# EAGLE design DCDCDC (EAGLE 9.1.3)
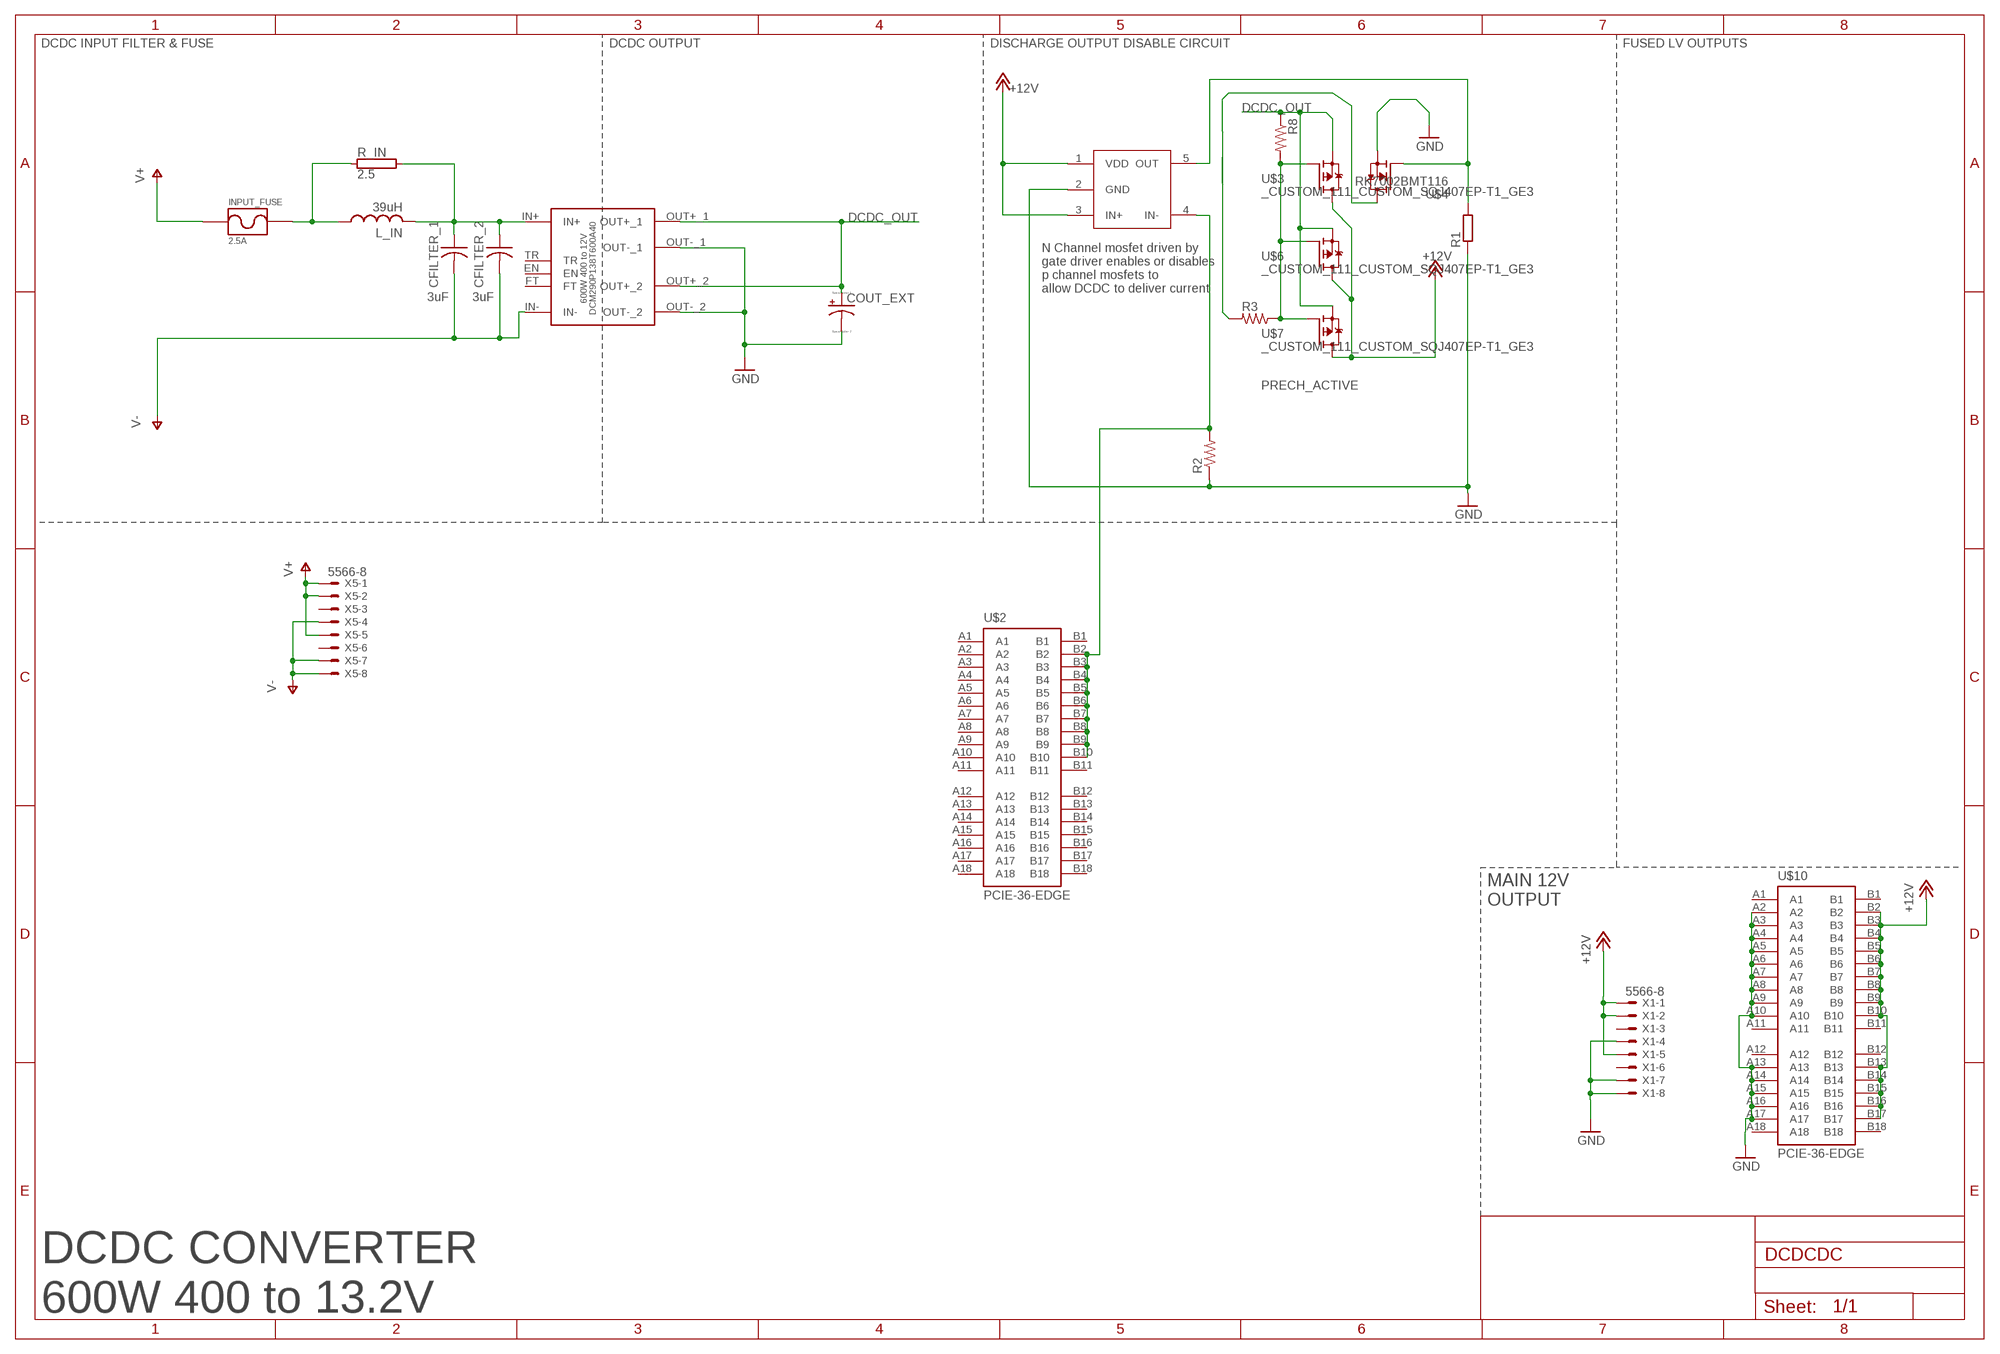
[diagram p0: schematic, sheet 1]

## Parts
CFILTER_1  3uF  B58035U5305M062  [CERALINK_FA3]
CFILTER_2  3uF  B58035U5305M062  [CERALINK_FA3]
COUT_EXT  CPOL-USE7.5-16  [E7,5-16]
DCM290P138T600A40  600W 400 to 12V  VICOR_CHIP_WITH_HEATSINK  [VICOR_CHIP_HEATSINK]
INPUT_FUSE  2.5A  _CUSTOM_PARTS_LF_885  [_CUSTOM_PARTS_LF_885]
L_IN  39uH  SRP1770TA-390M  [L_1510_NONSTANDARD]
R1  R-EU_R0805  [R0805]
R2  R-US_R0805  [R0805]
R3  R-US_R0805  [R0805]
R8  R-US_R0805  [R0805]
R_IN  2.5  RMG100-V  [TO-247-2V]
U$2  PCIE-36-EDGE  [PCI-E_SLOT_36]
U$3  _CUSTOM_111_CUSTOM_SQJ407EP-T1_GE3  [_CUSTOM_111_CUSTOM_TRANS_SIRA90DP-T1-GE3]
U$4  RK7002BMT116  [SOT23]
U$5  UCC27511AQDBVRQ1  [SOT23-5L]
U$6  _CUSTOM_111_CUSTOM_SQJ407EP-T1_GE3  [_CUSTOM_111_CUSTOM_TRANS_SIRA90DP-T1-GE3]
U$7  _CUSTOM_111_CUSTOM_SQJ407EP-T1_GE3  [_CUSTOM_111_CUSTOM_TRANS_SIRA90DP-T1-GE3]
U$10  PCIE-36-EDGE  [PCI-E_SLOT_36]
X1  5566-8  [5566-8]
X5  5566-8  [5566-8]

## Nets
+12V: U$3.5(D) U$5.1(VDD) U$5.3(IN+) U$6.5(D) U$7.5(D) U$10.B2 U$10.B3 U$10.B4 U$10.B5 U$10.B6 U$10.B7 U$10.B8 U$10.B9 U$10.B10 U$10.B13 U$10.B14 U$10.B15 U$10.B16 U$10.B17
DCDC_OUT: COUT_EXT.+ DCM290P138T600A40.OUT+_1 DCM290P138T600A40.OUT+_2 R8.1 U$3.1(S) U$3.2(S) U$3.3(S) U$6.1(S) U$6.2(S) U$6.3(S) U$7.1(S) U$7.2(S) U$7.3(S)
GND: COUT_EXT.- DCM290P138T600A40.OUT-_1 DCM290P138T600A40.OUT-_2 R1.1 R2.1 U$4.2(S) U$5.2(GND) U$10.A2 U$10.A3 U$10.A4 U$10.A5 U$10.A6 U$10.A7 U$10.A8 U$10.A9 U$10.A10 U$10.A13 U$10.A14 U$10.A15 U$10.A16 U$10.A17
N$1: R3.1 R8.2 U$3.4(G) U$6.4(G) U$7.4(G)
N$2: R1.2 U$4.1(G) U$5.5(OUT)
N$3 [LV]: CFILTER_1.P$1 CFILTER_2.P$1 DCM290P138T600A40.IN+ L_IN.P$2 R_IN.2
N$4: R3.2 U$4.3(D)
N$5 [LV]: X1.1 X1.2 X1.5
N$6 [LV]: X1.4 X1.7 X1.8
PRECH_ACTIVE: R2.2 U$2.B2 U$2.B3 U$2.B4 U$2.B5 U$2.B6 U$2.B7 U$2.B8 U$2.B9 U$2.B10 U$5.4(IN-)
V+ [LV]: INPUT_FUSE.P$1 X5.1 X5.2 X5.5
V+_FUSED [LV]: INPUT_FUSE.P$2 L_IN.P$1 R_IN.1
V- [LV]: CFILTER_1.P$2 CFILTER_2.P$2 DCM290P138T600A40.IN- X5.4 X5.7 X5.8
Unconnected: DCM290P138T600A40.EN DCM290P138T600A40.FT DCM290P138T600A40.TR U$2.A1 U$2.A2 U$2.A3 U$2.A4 U$2.A5 U$2.A6 U$2.A7 U$2.A8 U$2.A9 U$2.A10 U$2.A11 U$2.A12 U$2.A13 U$2.A14 U$2.A15 U$2.A16 U$2.A17 U$2.A18 U$2.B1 U$2.B11 U$2.B12 U$2.B13 U$2.B14 U$2.B15 U$2.B16 U$2.B17 U$2.B18 U$10.A1 U$10.A11 U$10.A12 U$10.A18 U$10.B1 U$10.B11 U$10.B12 U$10.B18 X1.3 X1.6 X5.3 X5.6

## Notes on the sheet
- DCDC INPUT FILTER & FUSE | DCDC OUTPUT | DISCHARGE OUTPUT DISABLE CIRCUIT | FUSED LV OUTPUTS
- N Channel mosfet driven by 
  gate driver enables or disables 
  p channel mosfets to 
  allow DCDC to deliver current
- MAIN 12V
  OUTPUT
- DCDC CONVERTER 
  600W 400 to 13.2V

## Library data of the parts
CFILTER_1 CFILTER_2 = _CUSTOM:B58035U5305M062
COUT_EXT = resistor:CPOL-US: POLARIZED CAPACITOR, American symbol
DCM290P138T600A40 = 111_Custom:VICOR_CHIP_WITH_HEATSINK
INPUT_FUSE = _CUSTOM:_CUSTOM_PARTS_LF_885
L_IN = _CUSTOM:SRP1770TA-390M
R1 = rcl:R-EU_: RESISTOR, European symbol; SPICEPREFIX: R
R2 R3 R8 = rcl:R-US_: RESISTOR, American symbol; SPICEPREFIX: R
R_IN = resistor-power:RMG100: TO-247 Power Resistor - RMG 100 Series Source: www.token.com.tw .. power-resistor-rmg100pdf; OC_FARNELL: unknown; OC_NEWARK: unknown
U$2 U$10 = ACC-MB-R0:PCIE-36-EDGE
U$3 U$6 U$7 = PDM_2019_RevB:_CUSTOM_111_CUSTOM_SQJ407EP-T1_GE3
U$4 = 111_Custom:RK7002BMT116
U$5 = _CUSTOM:UCC27511AQDBVRQ1
X1 X5 = con-molex:5566-8: Mini FIT connector 8 pol Source: http://www.molex.com; MF: MOLEX; OC_FARNELL: unknown; OC_NEWARK: unknown

## Net classes
0 default: width 1 mm, clearance 0.152 mm
1 LV: clearance 0.001 mm

## Board
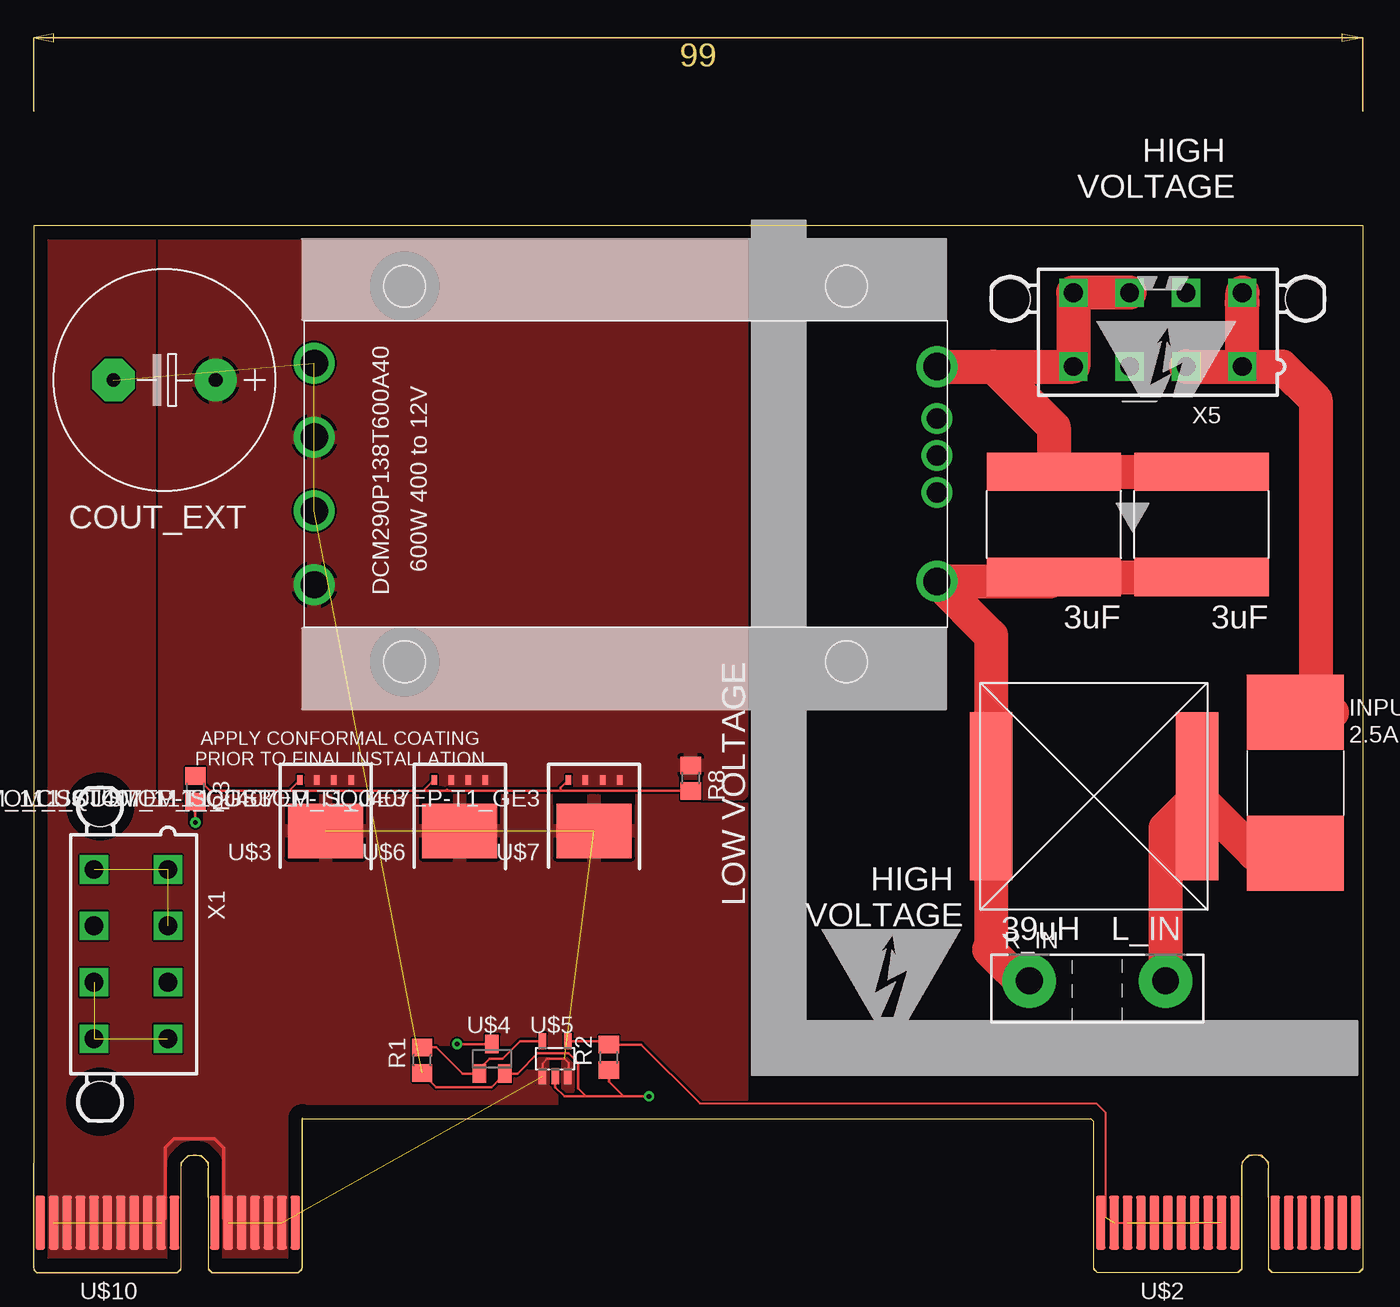
[diagram p1: board, top side]
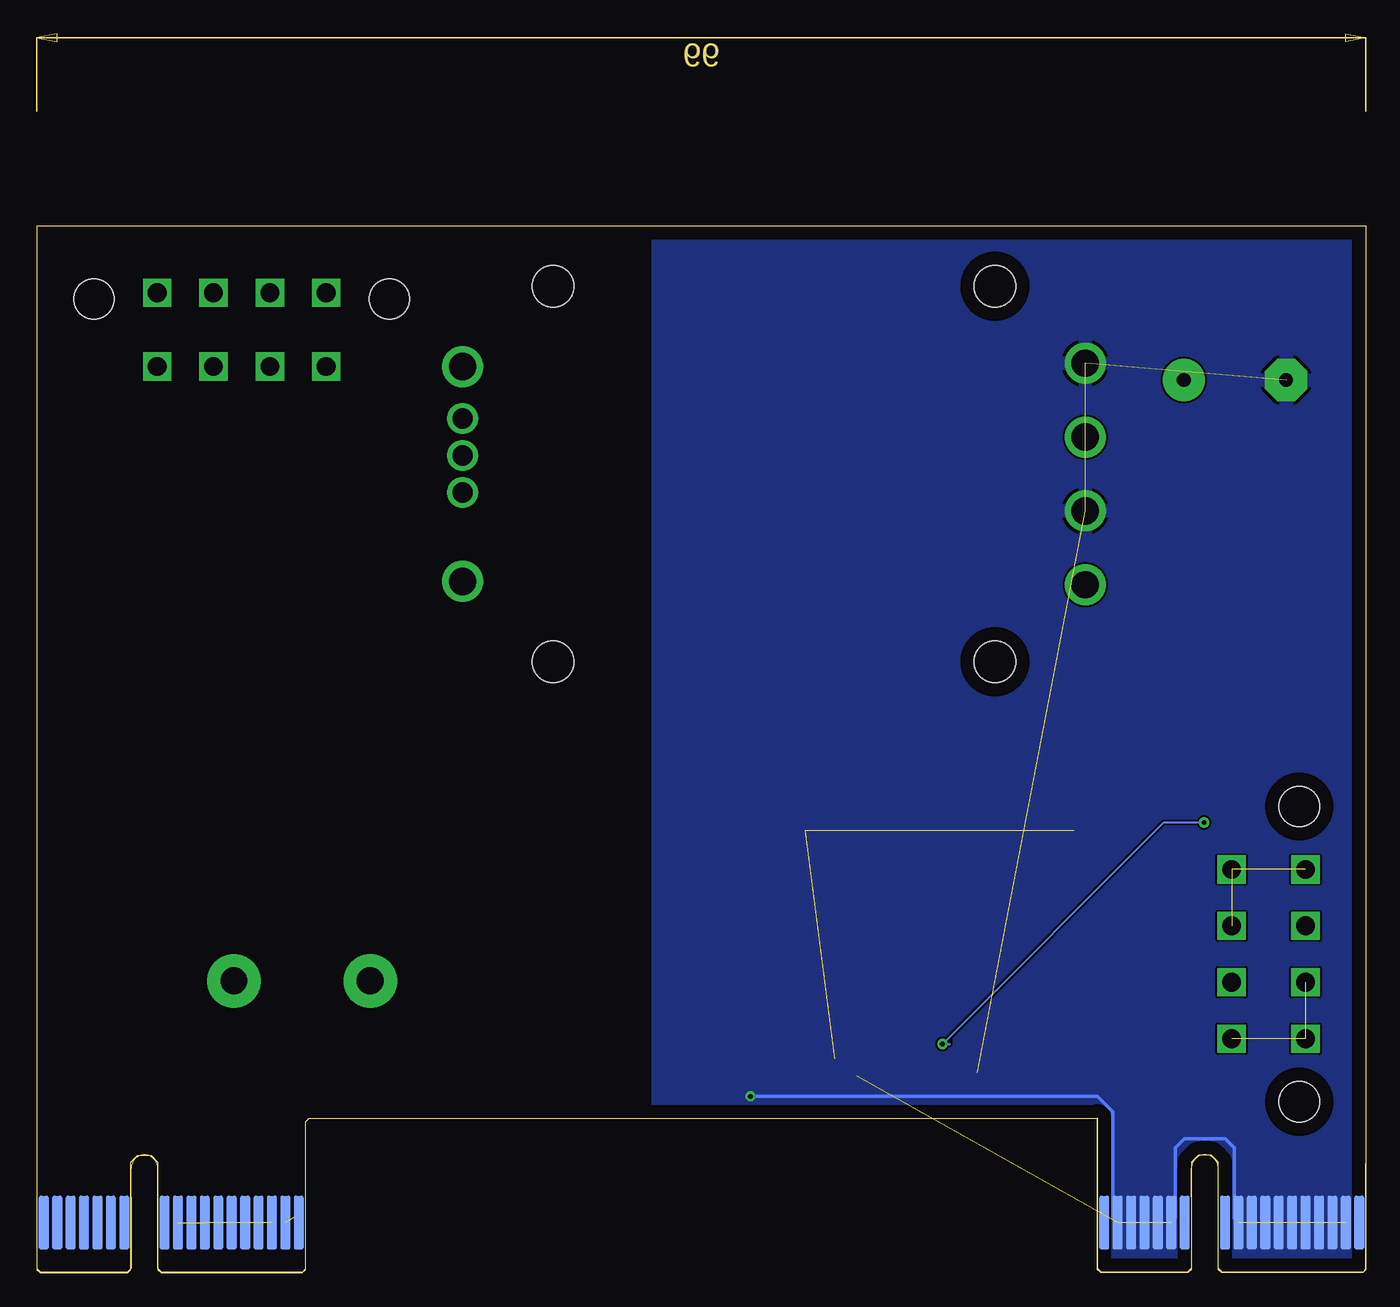
[diagram p2: board, bottom side, seen from below]

Size 99 x 78 mm. Coordinates in mm from the lower left corner, seen from the top.
Outline: 99,78 0,78 0,0.25 0.25,0 10.75,0 11,0.25 11,8.25 11.5,8.75 12.5,8.75 13,8.25 13,0.25 13.25,0 19.75,0 20,0.25 20,11.5 78.75,11.5 79,11.25 79,0.25 79.25,0 89.75,0 90,0.25 90,8.25 90.5,8.75 91.5,8.75 92,8.25 92,0.25 92.25,0 98.75,0 99,0.25 99,78
Copper layers (1*16): Top 0.035mm / dielectric 1.5mm / Bottom 0.035mm
Design rules "default": minimum track width 6mil, minimum drill 0.35mm, track to track 6mil, track to pad 6mil, pad to pad 6mil, via to via 6mil, smd to smd 6mil, copper to edge 40mil, drill to drill 6mil, minimum pad ring 10mil, minimum via ring 8mil, stop-mask expansion 4mil, vias tented up to drill 0mil, thermal gap 10mil

### Footprints (pad centres in the part's own frame; a part is rotated, then mirrored left to right if it is on the bottom)
CERALINK_FA3 = smd 2.85 x 10: P$1 -3.925,0; P$2 3.925,0
E7,5-16 = drill 1.016 pad 3.15: + -3.81,0 | drill 1.016 pad 3.15 octagon: - 3.81,0
VICOR_CHIP_HEATSINK = drill 1.52 pad 1.77: EN -23.19,-1.38; FT -23.19,-4.13; TR -23.19,1.38 | drill 2.03 pad 2.28: IN+ -23.19,8; IN- -23.19,-8 | drill 2.03 pad 2.41: OUT+_1 23.19,8.25; OUT+_2 23.19,-2.75; OUT-_1 23.19,2.75; OUT-_2 23.19,-8.25 | hole 3.1: -16.47,13.97; -16.47,-13.97; 16.47,13.97; 16.47,-13.97
_CUSTOM_PARTS_LF_885 = smd 5.6 x 7.23: P$1 5.25,0; P$2 -5.25,0
L_1510_NONSTANDARD = smd 3.15 x 12.5: P$1 -7.675,0; P$2 7.675,0
R0805 = smd 1.3 x 1.5: 1 -0.95,0; 2 0.95,0
TO-247-2V = drill 2 pad 4: 1 -5.08,0; 2 5.08,0
PCI-E_SLOT_36 = smd 0.7 x 4 bottom: A1 0.245,3.75; A2 1.245,3.75; A3 2.245,3.75; A4 3.245,3.75; A5 4.245,3.75; A6 5.245,3.75; A7 6.245,3.75; A8 7.245,3.75; A9 8.245,3.75; A10 9.245,3.75; A11 10.245,3.75; A12 13.245,3.75; A13 14.245,3.75; A14 15.245,3.75; A15 16.245,3.75; A16 17.245,3.75; A17 18.245,3.75; A18 19.245,3.75 | smd 0.7 x 4: B1 0.245,3.75; B2 1.245,3.75; B3 2.245,3.75; B4 3.245,3.75; B5 4.245,3.75; B6 5.245,3.75; B7 6.245,3.75; B8 7.245,3.75; B9 8.245,3.75; B10 9.245,3.75; B11 10.245,3.75; B12 13.245,3.75; B13 14.245,3.75; B14 15.245,3.75; B15 16.245,3.75; B16 17.245,3.75; B17 18.245,3.75; B18 19.245,3.75
_CUSTOM_111_CUSTOM_TRANS_SIRA90DP-T1-GE3 = smd 0.41 x 0.72: 1 -1.905,-2.715; 2 -0.635,-2.715; 3 0.635,-2.715; 4 1.905,-2.715 | smd 5.588 x 4.064: 5 0,1.08
SOT23 = smd 1 x 1.4: 1 -0.95,-1.1; 2 0.95,-1.1; 3 0,1.1
SOT23-5L = smd 0.55 x 1.2: 1 -0.95,-1.3; 2 0,-1.3; 3 0.95,-1.3; 4 0.95,1.3; 5 -0.95,1.3
5566-8 = drill 1.4 square: 1 6.3,-2.75; 2 2.1,-2.75; 3 -2.1,-2.75; 4 -6.3,-2.75; 5 6.3,2.75; 6 2.1,2.75; 7 -2.1,2.75; 8 -6.3,2.75 | hole 3: 11,2.29; -11,2.29

### Placement (x,y rotation side)
CFILTER_1  87,55.75 90 top
CFILTER_2  76,55.75 90 top
COUT_EXT  9.75,66.5 180 top
DCM290P138T600A40  44.1,59.5 180 top
INPUT_FUSE  94,36.5 90 top
L_IN  79,35.5 180 top
R1  28.95,15.85 90 top
R2  42.85,16.05 90 top
R3  12.05,36.05 270 top
R8  48.95,36.85 270 top
R_IN  79.25,21.75 180 top
U$2  79.25,0 0 top
U$3  21.75,34 180 top
U$4  34.15,15.95 0 top
U$5  38.85,15.95 0 top
U$6  31.75,34 180 top
U$7  41.75,34 180 top
U$10  0.25,0 0 top
X1  7.25,23.75 90 top
X5  83.75,70.25 0 top

### Tracks (layer width: path | path; a pad name or v marks a point on that pad's centre or on a via)
+12V  (16 unrouted)
  Top 0.2: U$5.1 37.9,15.6 38.25,15.95 39.55,15.95 39.85,15.65 39.85,14.7 U$5.3
  Top 0.254: 14.25,4 U$10.B13 14.17,4.07 14.17,9.31 13.5,9.98 10.49,9.98 9.82,9.31 9.82,4.07 U$10.B10
  pour Top (rank 2): 0,-0.4 52.75,-0.4 52.75,35.75 9.75,35.75 9.75,78.25 0,78.25
DCDC_OUT
  pour Top: 52.75,35.7 9.75,35.7 9.75,78 52.75,78
GND  (via drill 0.35)  (15 unrouted)
  Top 0.2: U$5.2 38.85,13.85 39.55,13.15 41.15,13.15 | 41.15,13.15 40.55,13.75 40.55,15.65 39.85,16.35 37.55,16.35 36.05,14.85 U$4.2 34.1,13.85 30,13.85 R1.1 | 41.15,13.15 42.35,13.15 43.95,13.15 | R2.1 42.85,14.25 43.95,13.15 | 43.95,13.15 45.75,13.15
  Top 0.254: 45.75,13.15 v45.85,13.15
  Bottom 0.254: U$10.A17 18.86,4.11 18.86,12.01 20,13.15 v45.85,13.15 | U$10.A10 9.81,4.06 9.81,9.32 10.48,9.99 13.51,9.99 14.18,9.32 14.18,4.06 U$10.A13
  pour Bottom: 52.75,-0.5 0,-0.5 0,77.75 52.75,77.75
N$1
  Top 0.2: R8.2 41.91,35.9 39.25,35.9 30.91,35.9 | 30.91,35.9 30.8,36 | 30.91,35.9 29,35.9 19.91,35.9 19,35.9 13.15,35.9 R3.1
  Top 0.203: U$7.4 39.25,36.12 39.25,35.9 | U$6.4 29.03,35.9 29,35.9 | U$3.4 19.03,35.9 19,35.9
N$2
  Top 0.2: U$5.5 36.25,17.25 34.95,15.95 33.95,15.95 33.2,15.2 U$4.1 31.95,14.85 30,16.8 R1.2
N$3
  Top 1: L_IN.P$2 71.33,38.67 | 73.36,51.83 CFILTER_2.P$1
  Top 1.27: 73.22,51.83 CFILTER_2.P$1
  Top 2.54: CFILTER_1.P$1 CFILTER_2.P$1 75.67,51.5 DCM290P138T600A40.IN+ 71.33,47.47 L_IN.P$2 71.33,24.23 71.17,24.08 | 71.17,24.08 74.17,21.08 R_IN.2 | 71.25,24 71.17,24.08
N$4  (via drill 0.35)
  Top 0.2: R3.2 v12.05,33.55 | v31.55,17.05 U$4.3
  Bottom 0.152: v31.54,17.05 15.04,33.55 v12.05,33.55
  Bottom 0.2: v31.55,17.05 v31.54,17.05 31.04,17.05
N$5  (2 unrouted)
N$6  (2 unrouted)
PRECH_ACTIVE  (8 unrouted)
  Top 0.152: 79.84,4.15 79.84,11.95 79.17,12.62 49.62,12.62 | U$2.B2 U$2.B10
  Top 0.2: U$5.4 42.6,17.25 R2.2 45.25,17 49.62,12.62
V+
  Top 2.54: X5.2 X5.1 | X5.1 90.05,72.2 90,72.25 90.05,72.3 X5.5 | 96.71,41.75 INPUT_FUSE.P$1 95.5,43.25 95.5,65 93,67.5 X5.1
V+_FUSED
  Top 1: 86.67,39.67 L_IN.P$1
  Top 2.54: 84.42,21.84 R_IN.1 84.33,33.16 L_IN.P$1 90.92,31.25 INPUT_FUSE.P$2
V-
  Top 1: 74.33,59.67 CFILTER_2.P$2
  Top 2.54: X5.7 X5.8 X5.4 71.5,67.5 | DCM290P138T600A40.IN- 71.5,67.5 | 71.5,67.5 76,63 CFILTER_2.P$2 CFILTER_1.P$2

### Text on the board
tPlace: HIGH / VOLTAGE | LOW VOLTAGE | APPLY CONFORMAL COATING / PRIOR TO FINAL INSTALLATION | HIGH / VOLTAGE